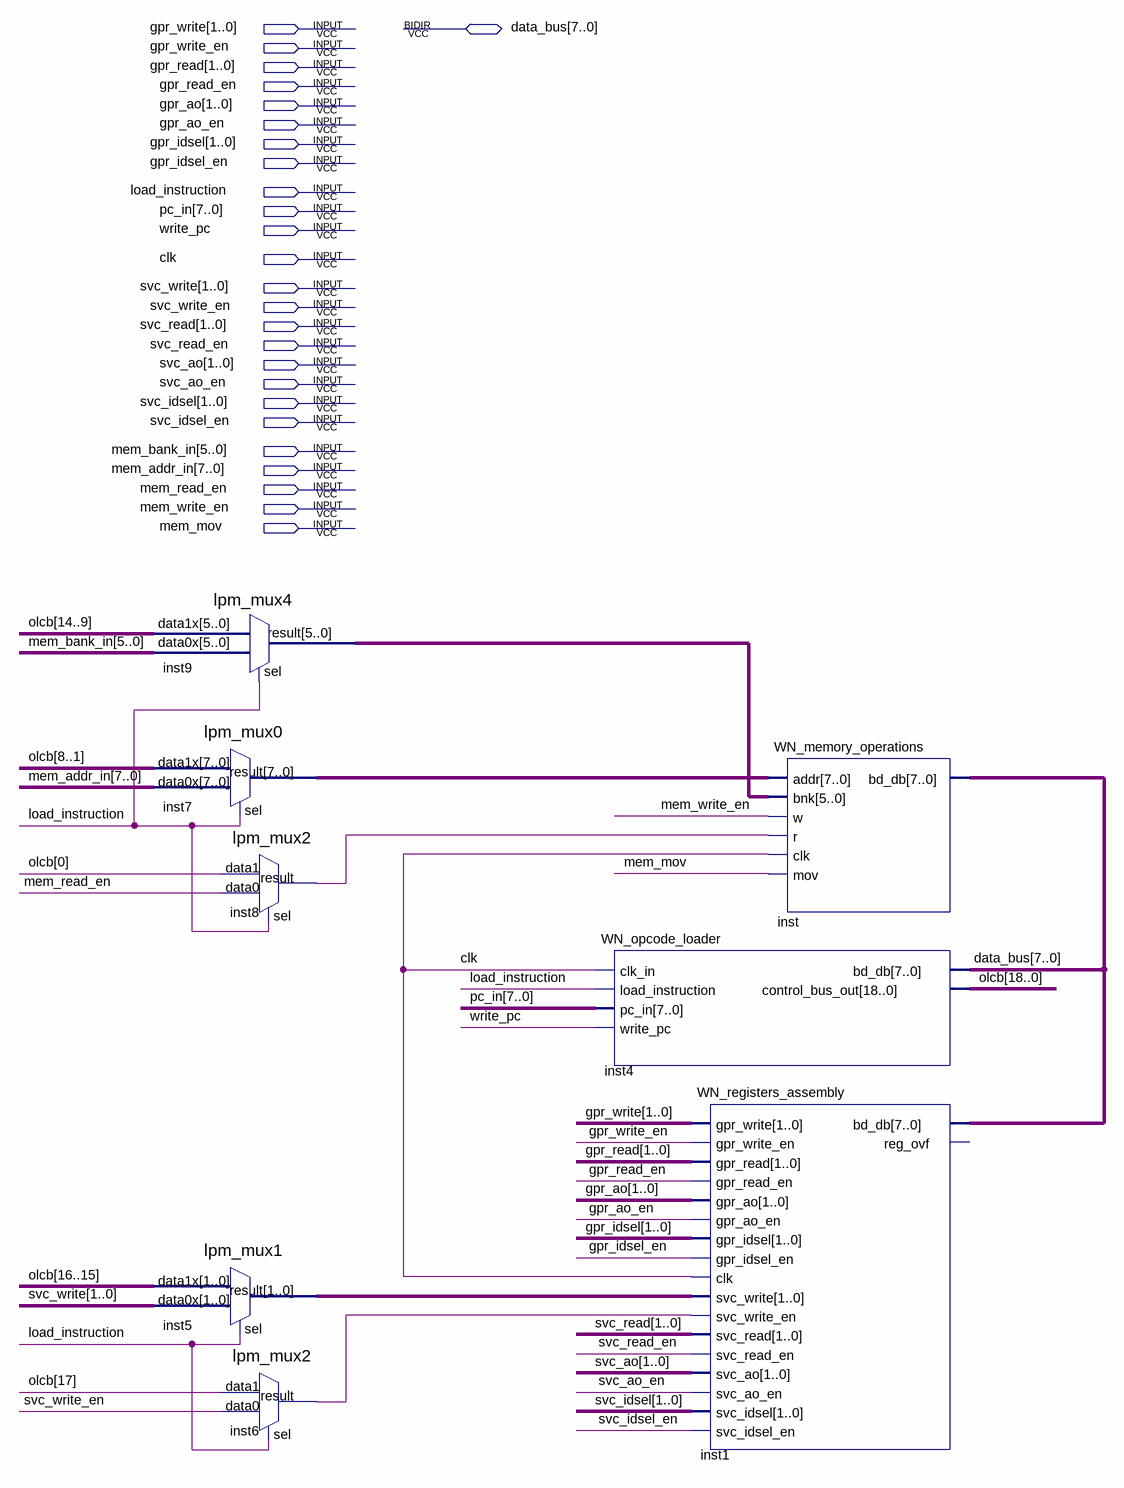
[diagram p0: schematic sheet]
// Quartus schematic WellNo.bdf as structural Verilog: 8 symbols, 26 pins
module WellNo (
  input  [1:0] gpr_write,
  input  gpr_write_en,
  input  [1:0] gpr_read,
  input  gpr_read_en,
  input  [1:0] gpr_ao,
  input  gpr_ao_en,
  input  [1:0] gpr_idsel,
  input  gpr_idsel_en,
  input  load_instruction,
  input  [7:0] pc_in,
  input  write_pc,
  input  clk,
  input  [1:0] svc_write,
  input  svc_write_en,
  input  [1:0] svc_read,
  input  svc_read_en,
  input  [1:0] svc_ao,
  input  svc_ao_en,
  input  [1:0] svc_idsel,
  input  svc_idsel_en,
  input  [5:0] mem_bank_in,
  input  [7:0] mem_addr_in,
  input  mem_read_en,
  input  mem_write_en,
  input  mem_mov,
  inout  [7:0] data_bus
);

  wire inst6_result, inst8_result;
  wire [1:0] inst5_result;
  wire [5:0] inst9_result;
  wire [7:0] inst7_result;
  wire [18:0] olcb;

  lpm_mux4 inst9 (.data1x(olcb[14:9]), .data0x(mem_bank_in), .sel(load_instruction), .result(inst9_result));
  lpm_mux0 inst7 (.data1x(olcb[8:1]), .data0x(mem_addr_in), .sel(load_instruction), .result(inst7_result));
  lpm_mux1 inst5 (.data1x(olcb[16:15]), .data0x(svc_write), .sel(load_instruction), .result(inst5_result));
  lpm_mux2 inst8 (.data1(olcb[0]), .data0(mem_read_en), .sel(load_instruction), .result(inst8_result));
  lpm_mux2 inst6 (.data1(olcb[17]), .data0(svc_write_en), .sel(load_instruction), .result(inst6_result));
  WN_opcode_loader inst4 (
    .clk_in(clk), .load_instruction(load_instruction), .pc_in(pc_in), .write_pc(write_pc),
    .control_bus_out(olcb), .bd_db(data_bus));
  WN_registers_assembly inst1 (
    .gpr_write(gpr_write), .gpr_write_en(gpr_write_en), .gpr_read(gpr_read), .gpr_read_en(gpr_read_en),
    .gpr_ao(gpr_ao), .gpr_ao_en(gpr_ao_en), .gpr_idsel(gpr_idsel), .gpr_idsel_en(gpr_idsel_en), .clk(clk),
    .svc_write(inst5_result), .svc_write_en(inst6_result), .svc_read(svc_read), .svc_read_en(svc_read_en),
    .svc_ao(svc_ao), .svc_ao_en(svc_ao_en), .svc_idsel(svc_idsel), .svc_idsel_en(svc_idsel_en),
    .bd_db(data_bus));  // open: reg_ovf
  WN_memory_operations inst (
    .addr(inst7_result), .bnk(inst9_result), .w(mem_write_en), .r(inst8_result), .clk(clk), .mov(mem_mov),
    .bd_db(data_bus));
endmodule
